# EAGLE schematic eletric (EAGLE 9.6.2)
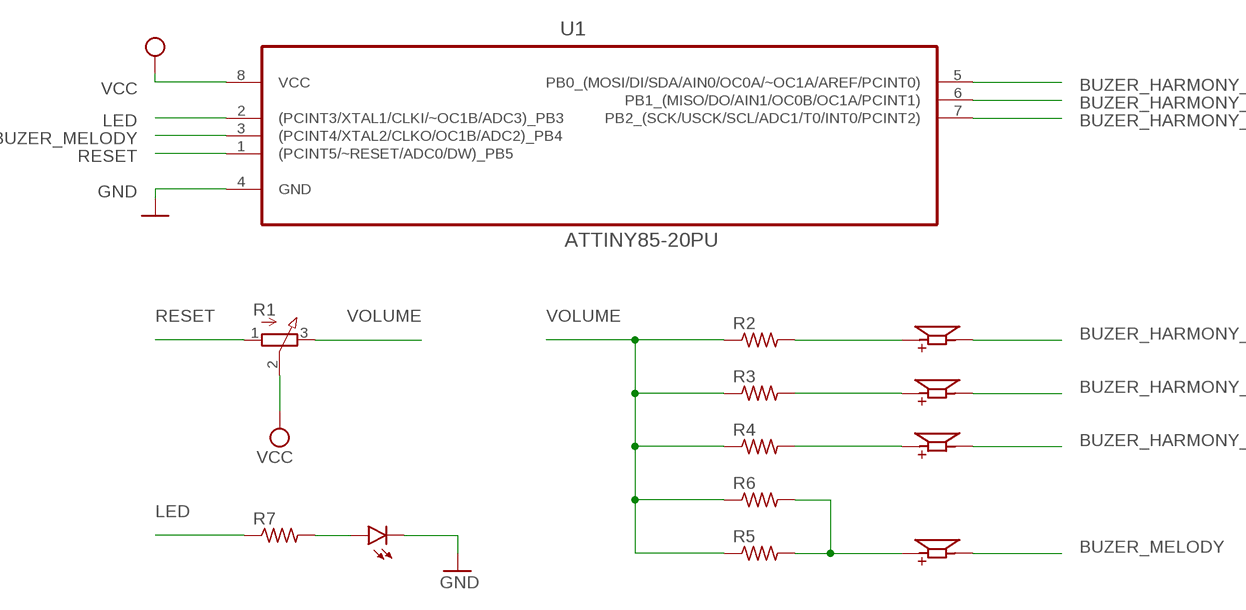
[diagram p0: schematic, sheet 1]

## Parts
LED2  LED5MM  [LED5MM]
LS1  CMT-8530S-SMT  [CUI_CMT-8530S-SMT]
LS2  CMT-8530S-SMT  [CUI_CMT-8530S-SMT]
LS3  CMT-8530S-SMT  [CUI_CMT-8530S-SMT]
LS4  CMT-8530S-SMT  [CUI_CMT-8530S-SMT]
R1  3RP/1610N  [3RP/1610N]
R2  R-US_R0805  [R0805]
R3  R-US_R0805  [R0805]
R4  R-US_R0805  [R0805]
R5  R-US_R0805  [R0805]
R6  R-US_R0805  [R0805]
R7  R-US_R0805  [R0805]
U1  ATTINY85-20PU  [DIP254P762X533-8]

## Nets
BUZER_HARMONY_1: LS2.N U1.7(PB2_(SCK/USCK/SCL/ADC1/T0/INT0/PCINT2))
BUZER_HARMONY_2: LS4.N U1.6(PB1_(MISO/DO/AIN1/OC0B/OC1A/PCINT1))
BUZER_HARMONY_3: LS3.N U1.5(PB0_(MOSI/DI/SDA/AIN0/OC0A/~OC1A/AREF/PCINT0))
BUZER_MELODY: LS1.N U1.3((PCINT4/XTAL2/CLKO/OC1B/ADC2)_PB4)
GND: LED2.K(C) U1.4(GND)
LED: R7.1 U1.2((PCINT3/XTAL1/CLKI/~OC1B/ADC3)_PB3)
N$2: LS4.P R3.2
N$3: LS2.P R2.2
N$4: LS3.P R4.2
N$5: LED2.A R7.2
N$6: LS1.P R5.2 R6.2
RESET: R1.1(A) U1.1((PCINT5/~RESET/ADC0/DW)_PB5)
VCC: R1.2(S) U1.8(VCC)
VOLUME: R1.3(E) R2.1 R3.1 R4.1 R5.1 R6.1

## Library data of the parts
LED2 = led:LED: LED OSRAM: - CHIPLED LG R971, LG N971, LY N971, LG Q971, LY Q971, LO R971, LY R971 LH N974, LH R974 LS Q976, LO Q976, LY Q976 LO Q996 - Hyper CHIPLED LW Q18S LB Q993, LB Q99A, LB R99A - SideLED LS A670, LO A670, LY A670, LG A670, LP A670 LB A673, LV A673, LT A673, LW A673 LH A674 LY A675 LS A676, LA A676, LO A676, LY A676, LW A676 LS A679, LY A679, LG A679 - Hyper Micro SIDELED® LS Y876, LA Y876, LO Y876, LY Y876 LT Y87S - SmartLED LW L88C, LW L88S LB L89C, LB L89S, LG L890 LS L89K, LO L89K, LY L89K LS L896, LA L896, LO L896, LY L896 - TOPLED LS T670, LO T670, LY T670, LG T670, LP T670 LSG T670, LSP T670, LSY T670, LOP T670, LYG T670 LG T671, LOG T671, LSG T671 LB T673, LV T673, LT T673, LW T673 LH T674 LS T676, LA T676, LO T676, LY T676, LB T676, LH T676, LSB T676, LW T676 LB T67C, LV T67C, LT T67C, LS T67K, LO T67K, LY T67K, LW E67C LS E67B, LA E67B, LO E67B, LY E67B, LB E67C, LV E67C, LT E67C LW T67C LS T679, LY T679, LG T679 LS T770, LO T770, LY T770, LG T770, LP T770 LB T773, LV T773, LT T773, LW T773 LH T774 LS E675, LA E675, LY E675, LS T675 LS T776, LA T776, LO T776, LY T776, LB T776 LHGB T686 LT T68C, LB T68C - Hyper Mini TOPLED® LB M676 - Mini TOPLED Santana® LG M470 LS M47K, LO M47K, LY M47K Source: http://www.osram.convergy.de LUXEON: - LUMILED® LXK2-PW12-R00, LXK2-PW12-S00, LXK2-PW14-U00, LXK2-PW14-V00 LXK2-PM12-R00, LXK2-PM12-S00, LXK2-PM14-U00 LXK2-PE12-Q00, LXK2-PE12-R00, LXK2-PE12-S00, LXK2-PE14-T00, LXK2-PE14-U00 LXK2-PB12-K00, LXK2-PB12-L00, LXK2-PB12-M00, LXK2-PB14-N00, LXK2-PB14-P00, LXK2-PB14-Q00 LXK2-PR12-L00, LXK2-PR12-M00, LXK2-PR14-Q00, LXK2-PR14-R00 LXK2-PD12-Q00, LXK2-PD12-R00, LXK2-PD12-S00 LXK2-PH12-R00, LXK2-PH12-S00 LXK2-PL12-P00, LXK2-PL12-Q00, LXK2-PL12-R00 Source: www.luxeon.com KINGBRIGHT: KA-3528ASYC Source: www.kingbright.com
LS1-LS4 = CMT-8530S-SMT:CMT-8530S-SMT: 8.5 mm, 3.6 Vo-p, 90 dB, Surface Mount (SMT), Magnetic Audio Transducer Buzzer Check prices <https://pricing.snapeda.com/parts/CMT-8530S-SMT-TR/CUI%20Devices/view-part?ref=eda>; AVAILABILITY: Good; CUI_PURCHASE_URL: https://www.cuidevices.com/product/audio/buzzers/audio-transducers/cmt-8530s-smt-tr?utm_source=snapeda.com&utm_medium=referral&utm_campaign=snapedaBOM; DESCRIPTION: 8.5 mm, 3.6 Vo-p, 90 dB, Surface Mount (SMT), Magnetic Audio Transducer Buzzer; MF: CUI Devices; MP: CMT-8530S-SMT-TR; PACKAGE: CUI; PRICE: None; PURCHASE-URL: https://pricing.snapeda.com/search/part/CMT-8530S-SMT-TR/?ref=eda
R1 = pot:3RP/1610N: 16mm Potentiometer one level Source: http://www.alphapotentiometers.net/html/16mm_pot_2.html
R2-R7 = rcl:R-US_: RESISTOR, American symbol; SPICEPREFIX: R
U1 = ATTINY85-20PU:ATTINY85-20PU: 8-bit Microcontroller with In-System Programmable Flash Check prices <https://pricing.snapeda.com/parts/ATTINY85-20PU/Microchip/view-part?ref=eda>; AVAILABILITY: Good; DESCRIPTION: AVR AVR® ATtiny, Functional Safety (FuSa) Microcontroller IC 8-Bit 20MHz 8KB (4K x 16) FLASH 8-PDIP; MF: Microchip; MP: ATTINY85-20PU; PACKAGE: DIP-8 Microchip; PRICE: None; PURCHASE-URL: https://pricing.snapeda.com/search/part/ATTINY85-20PU/?ref=eda